# EAGLE design fabflash-mk1 (EAGLE 6.5.0)
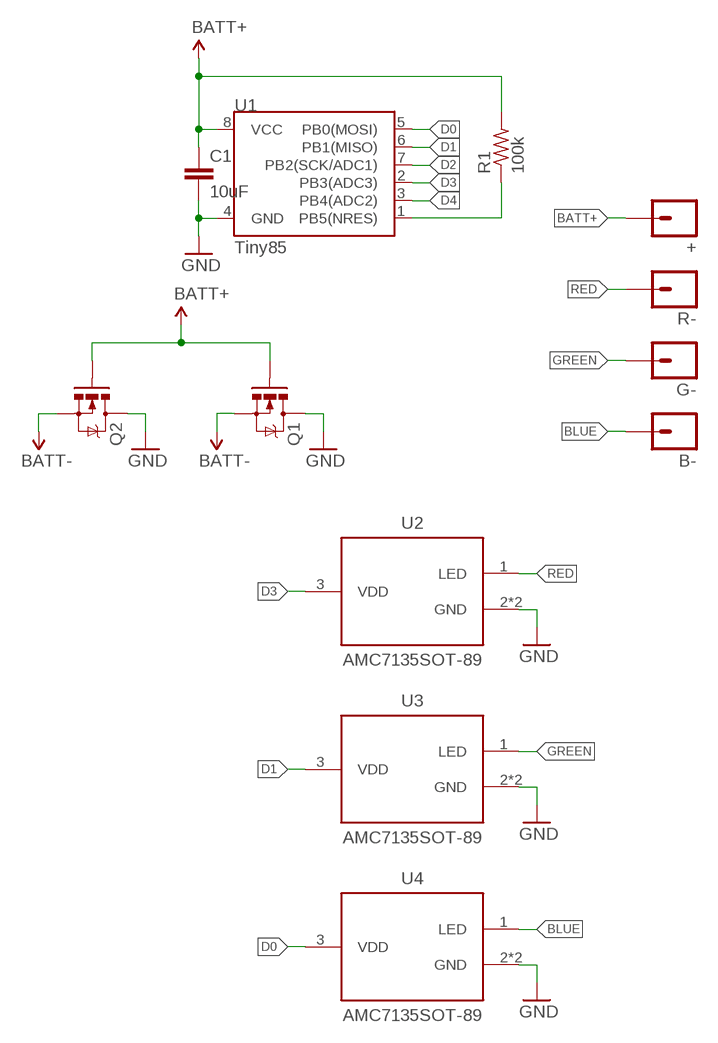
[diagram p0: schematic, sheet 1]

## Parts
+  M01PTH-1.2MM-NS  [1X01-1.2MM-NS]
B-  M01PTH-1.2MM-NS  [1X01-1.2MM-NS]
C1  10uF  CAPACITOR-CERAMICC0603  [C0603]
G-  M01PTH-1.2MM-NS  [1X01-1.2MM-NS]
Q1  MOSFET-NCHANNELIRLML2502  [SOT23]
Q2  MOSFET-NCHANNELIRLML2502  [SOT23]
R1  100k  RESISTORR0603  [R0603]
R-  M01PTH-1.2MM-NS  [1X01-1.2MM-NS]
U1  Tiny85  ATTINY45TINY85-20-SMT  [SO08-EIAJ]
U2  AMC7135SOT-89  [SOT89]
U3  AMC7135SOT-89  [SOT89]
U4  AMC7135SOT-89  [SOT89]

## Nets
BATT+: +.P$1 C1.1 Q1.1(G) Q2.1(G) R1.2 U1.8(VCC)
BATT-: Q1.2(S) Q2.2(S)
BLUE: B-.P$1 U4.1(LED)
D0: U1.5(PB0(MOSI)) U4.3(VDD)
D1: U1.6(PB1(MISO)) U3.3(VDD)
D2: U1.7(PB2(SCK/ADC1))
D3: U1.2(PB3(ADC3)) U2.3(VDD)
D4: U1.3(PB4(ADC2))
GND: C1.2 Q1.3(D) Q2.3(D) U1.4(GND) U2.2(GND) U2.4(GND) U3.2(GND) U3.4(GND) U4.2(GND) U4.4(GND)
GREEN: G-.P$1 U3.1(LED)
RED: R-.P$1 U2.1(LED)
RESET: R1.1 U1.1(PB5(NRES))

## Library data of the parts
+ B- G- R- = A_butts:M01: Header 1 Standard 1-pin 0.1" header. Use with straight break away headers (SKU : PRT-00116), right angle break away headers (PRT-00553), swiss pins (PRT-00743), machine pins (PRT-00117), and female headers (PRT-00115).
C1 = A_butts:CAPACITOR-CERAMIC: CAPACITOR, European symbol
Q1 Q2 = A_butts:MOSFET-NCHANNEL: Common NMOSFET Parts MFG P/N Store ID Prod ID FDD8780 TRANS-09984 SI7820DN TRANS-11055 FDS6630A IC-08089 2N7002PW TRANS-11151 FQP30N06L COM-10213 TRANS-10060 BSS123LT1G TRANS-08345 BSS138 TRANS-00830 BS170 2N7000
R1 = A_butts:RESISTOR: RESISTOR, American symbol
U1 = A_butts:ATTINY45: Atmel 8-pin 2/4/8kB flash uC; PROD_ID: IC-09092; VALUE: Tiny85-20-SMT
U2-U4 = A_butts:AMC7135

## Board
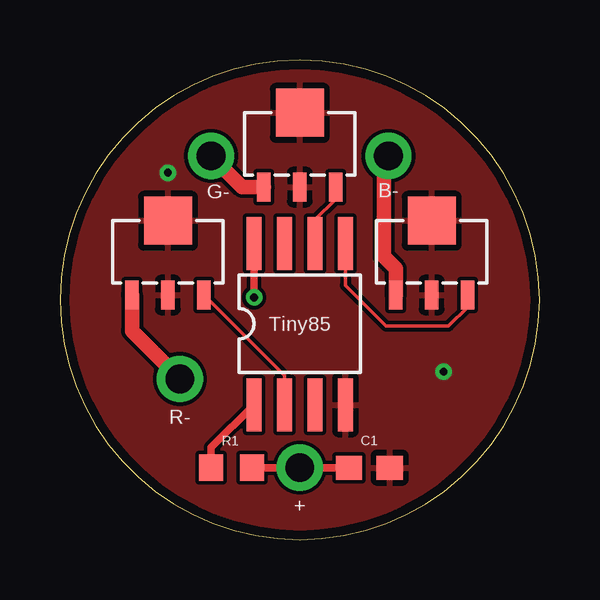
[diagram p1: board, top side]
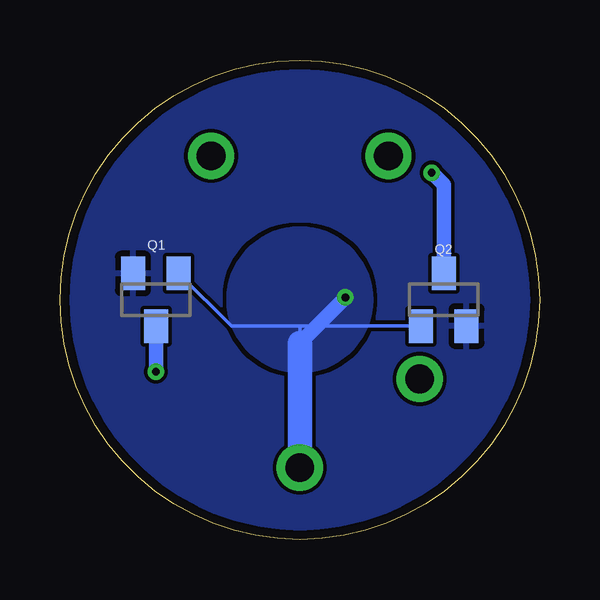
[diagram p2: board, bottom side, seen from below]

Size 20 x 20 mm. Coordinates in mm from the lower left corner, seen from the top.
Outline: 0,10 arc90 10,0 arc90 20,10 arc90 10,20 arc90 0,10
Copper layers (1*16): Top 0.0356mm / dielectric 1.5011mm / Bottom 0.0356mm
Design rules "LaenPCBOrder2": minimum track width 6mil, minimum drill 13mil, track to track 6mil, track to pad 6mil, pad to pad 6mil, via to via 6mil, smd to smd 6mil, copper to edge 15mil, drill to drill 6mil, minimum pad ring 7mil, minimum via ring 7mil, stop-mask expansion 3mil, vias tented up to drill 20mil, thermal gap 10mil

### Footprints (pad centres in the part's own frame; a part is rotated, then mirrored left to right if it is on the bottom)
1X01-1.2MM-NS = drill 1.2 pad 1.93: P$1 0,0
C0603 = smd 1.1 x 1: 1 -0.85,0; 2 0.85,0
SOT23 = smd 1 x 1.4: 1 -0.95,-1.1; 2 0.95,-1.1; 3 0,1.1
R0603 = smd 1 x 1.1: 1 -0.85,0; 2 0.85,0
SO08-EIAJ = smd 0.61 x 2.21: 1 -1.905,-3.378; 2 -0.635,-3.378; 3 0.635,-3.378; 4 1.905,-3.378; 5 1.905,3.353; 6 0.635,3.353; 7 -0.635,3.353; 8 -1.905,3.353
SOT89 = smd 0.58 x 1.2: 1 -1.5,-1.8; 2 0,-1.8; 3 1.5,-1.8 | smd 2 x 2: 4 0,1.3

### Placement (x,y rotation side)
+  10,3 180 top
B-  13.7,16 270 top
C1  12.9,3 0 top
G-  6.3,16 90 top
Q1  16,10 180 bottom
Q2  4,10 0 bottom
R1  7.16,3 0 top
R-  5,6.7 90 top
U1  10,9 0 top
U2  4.5,12 0 top
U3  10,16.5 0 top
U4  15.5,12 0 top

### Tracks (layer width: path | path; a pad name or v marks a point on that pad's centre or on a via)
BATT+  (via drill 0.33)
  Top 0.305: U1.8 v8.1,10.11 v8.1,10.1 | R1.2 +.P$1 C1.1
  Bottom 0.152: Q2.1 10,8.9 | 10,8.9 12.85,8.9 Q1.1 | 10,8.2 10,8.9
  Bottom 0.61: v8.1,10.1 10,8.2
  Bottom 1.016: 10,8.2 +.P$1
  pour Bottom: 7,10 arc90 10,7 arc90 13,10 arc90 10,13 arc90
BATT-
  pour Bottom (rank 6): 10,0 arc-90 0,10 arc-90 10,20 arc-90 20,10 arc-90
BLUE
  Top 0.61: U4.1 14,11.3 13.5,11.8 13.5,15.8 B-.P$1
D0
  Top 0.152: U1.5 11.9,10.6 13.6,8.9 16.2,8.9 17,9.7 U4.3
D1
  Top 0.152: U1.6 10.63,13.34 11.5,14.2 U3.3
D3
  Top 0.152: U1.2 9.37,6.83 U2.3
GND  (via drill 0.33)
  Bottom 0.61: Q2.3 4,14.8 v4.5,15.3 | Q1.3 v16,7
  pour Top: 10,0 arc-90 0,10 arc-90 10,20 arc-90 20,10 arc-90
GREEN
  Top 0.61: U3.1 7.6,14.7 G-.P$1
RED
  Top 0.61: U2.1 3,8.7 R-.P$1
RESET
  Top 0.305: R1.1 6.31,3.84 U1.1